# EAGLE design External_Controls_Board (EAGLE 6.6.0)
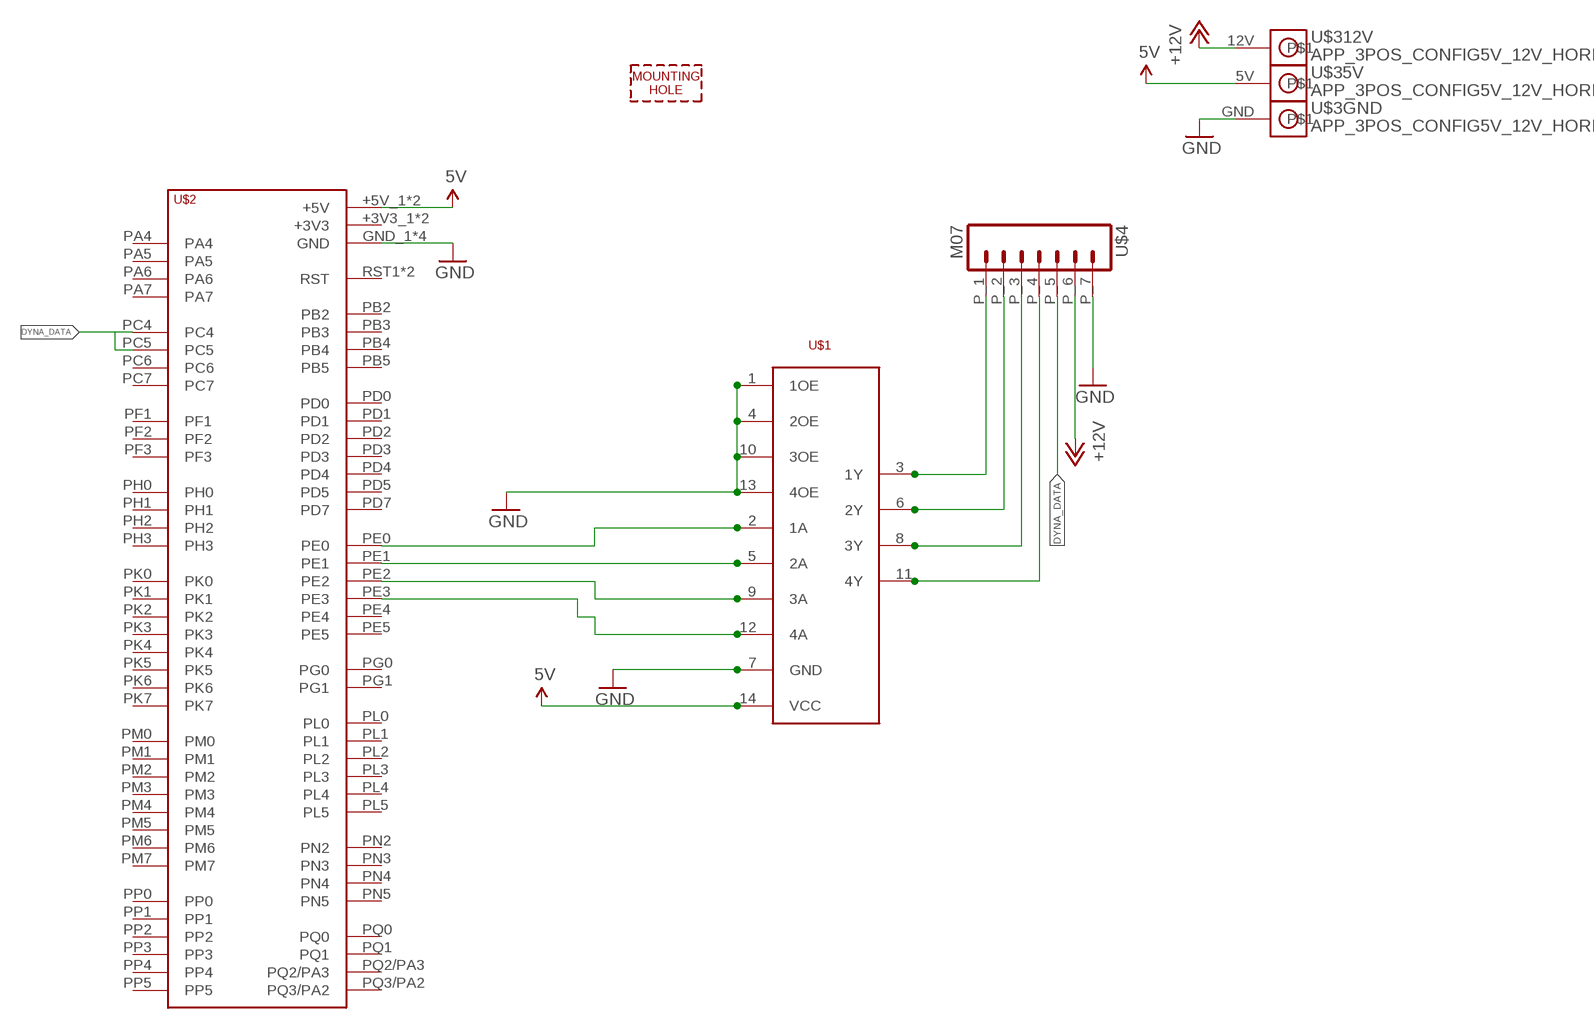
[diagram p0: schematic, sheet 1]

## Parts
U$1  SN74AHCT125  [SOIC14]
U$2  TIVA-C-CONNECTED  [TIVA-C-CONNECTED]
U$3  APP_3POS_CONFIG5V_12V_HORIZ  [APP45_5V_12V_HORIZ_CONFIG]
U$4  M07  [MOLEX_43650-07]
U$6  MOUNTING_HOLE#8  [#8_SCREW]

## Nets
+5V: U$1.14(VCC) U$2.+5V_1(+5V) U$2.+5V_2(+5V) U$3.5V ; supply symbol labelled 5V
+12V: U$3.12V U$4.P_6
DYNA_DATA: U$2.PC4 U$2.PC5 U$4.P_5
GND: U$1.1(1OE) U$1.4(2OE) U$1.7(GND) U$1.10(3OE) U$1.13(4OE) U$2.GND_1(GND) U$2.GND_2(GND) U$2.GND_3(GND) U$2.GND_4(GND) U$3.GND U$4.P_7
PWM0_3.3: U$1.12(4A) U$2.PE3
PWM0_5: U$1.11(4Y) U$4.P_4
PWM1_3.3: U$1.9(3A) U$2.PE2
PWM1_5: U$1.8(3Y) U$4.P_3
PWM2_3.3: U$1.5(2A) U$2.PE1
PWM2_5: U$1.6(2Y) U$4.P_2
PWM3_3.3: U$1.2(1A) U$2.PE0
PWM3_5: U$1.3(1Y) U$4.P_1
Unconnected: U$2.+3V3_1(+3V3) U$2.+3V3_2(+3V3) U$2.PA4 U$2.PA5 U$2.PA6 U$2.PA7 U$2.PB2 U$2.PB3 U$2.PB4 U$2.PB5 U$2.PC6 U$2.PC7 U$2.PD0 U$2.PD1 U$2.PD2 U$2.PD3 U$2.PD4 U$2.PD5 U$2.PD7 U$2.PE4 U$2.PE5 U$2.PF1 U$2.PF2 U$2.PF3 U$2.PG0 U$2.PG1 U$2.PH0 U$2.PH1 U$2.PH2 U$2.PH3 U$2.PK0 U$2.PK1 U$2.PK2 U$2.PK3 U$2.PK4 U$2.PK5 U$2.PK6 U$2.PK7 U$2.PL0 U$2.PL1 U$2.PL2 U$2.PL3 U$2.PL4 U$2.PL5 U$2.PM0 U$2.PM1 U$2.PM2 U$2.PM3 U$2.PM4 U$2.PM5 U$2.PM6 U$2.PM7 U$2.PN2 U$2.PN3 U$2.PN4 U$2.PN5 U$2.PP0 U$2.PP1 U$2.PP2 U$2.PP3 U$2.PP4 U$2.PP5 U$2.PQ0 U$2.PQ1 U$2.PQ2/PA3 U$2.PQ3/PA2 U$2.RST1(RST) U$2.RST_2(RST)

## Library data of the parts
U$1 = MRDT-Digital-ICs:SN74AHCT125: part # SN74AHCT125 QUADRUPLE BUS BUFFER GATES WITH 3-STATE OUTPUTS http://www.digikey.com/product-detail/en/SN74AHCT125DR/296-4652-1-ND/405208
U$2 = MRDT-2015-General:TIVA-C-CONNECTED: TIVA C CONNECTED LAUNCHPAD
U$3 = MRDT-Connectors:APP_3POS_CONFIG; COLOR1: YELLOW; COLOR2: RED; COLOR3: BLACK
U$4 = MRDT-Connectors:M07
U$6 = MRDT-Hardware:MOUNTING_HOLE: Mounting hole for M6 bolt. Standard use mounting hole for: Tiva C Connected - M6 Anderson Powerpole Mounting Wing - M8 Most frame-mounted PCB's - M8

## Board
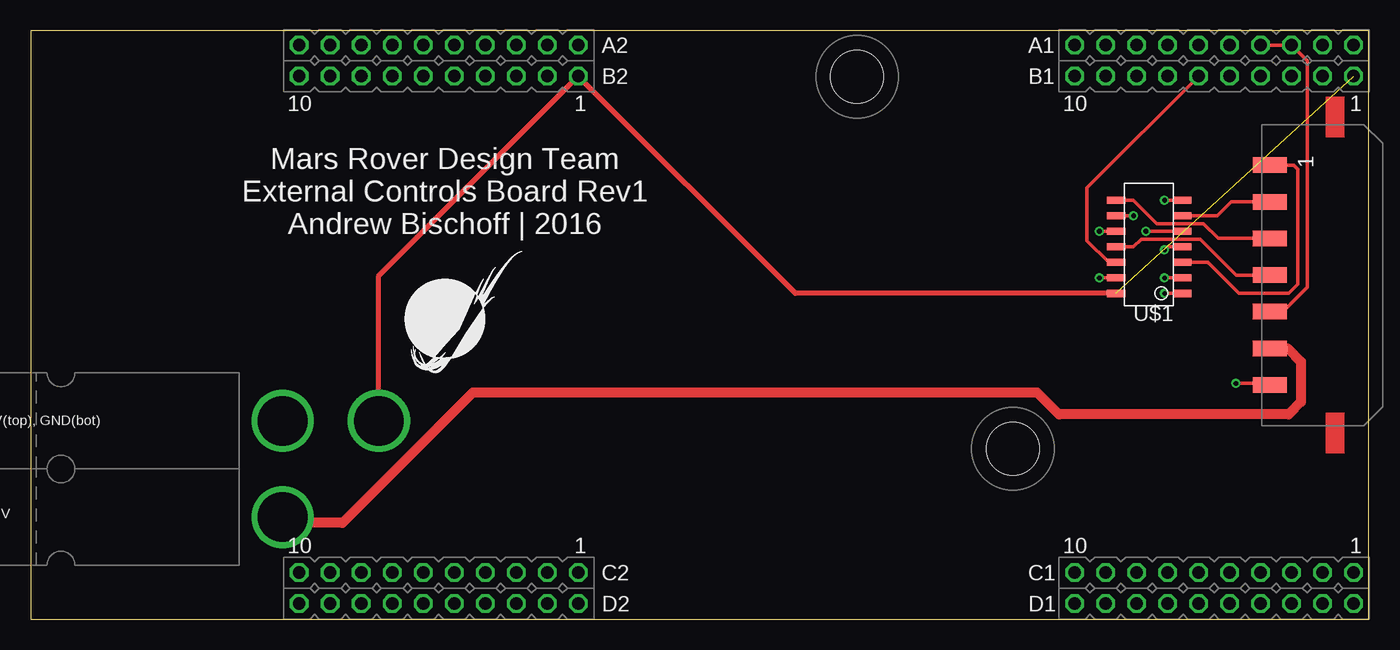
[diagram p1: board, top side]
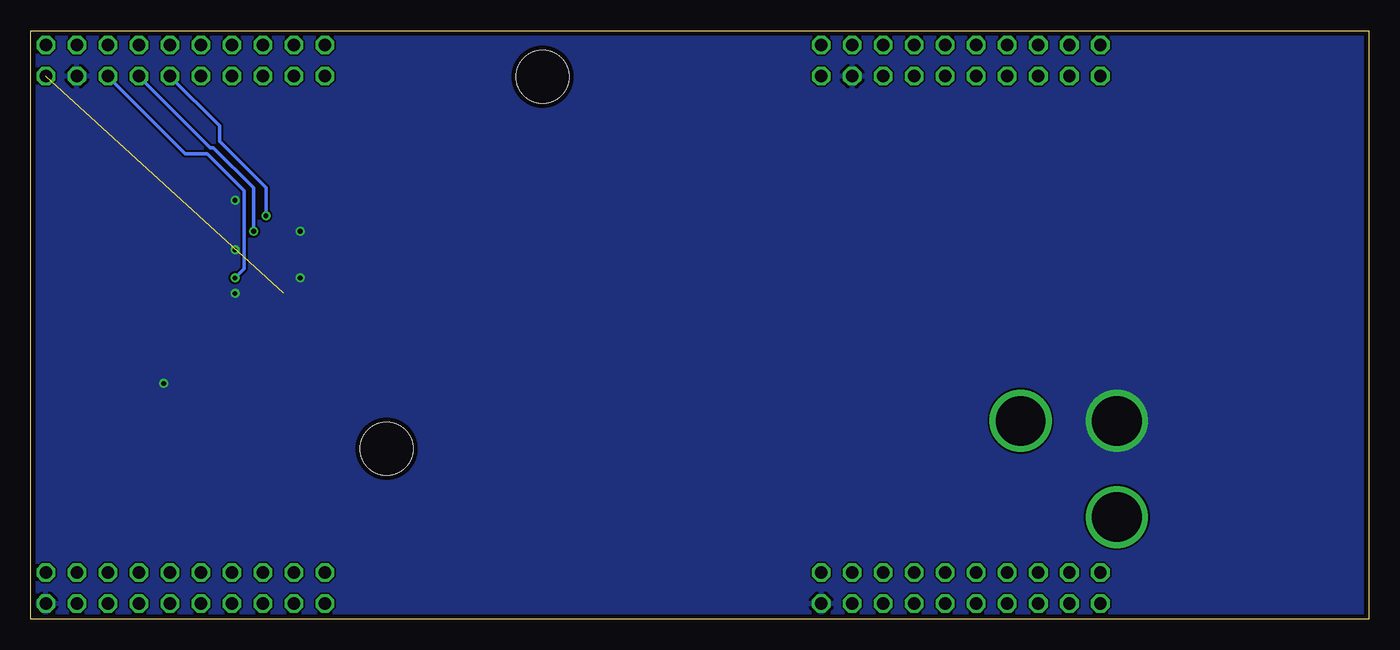
[diagram p2: board, bottom side, seen from below]

Size 109.61 x 48.18 mm. Coordinates in mm from the lower left corner, seen from the top.
Outline: 0,0 109.61,0 109.61,48.18 0,48.18 0,0
Copper layers (1*16): Top 0.0356mm / dielectric 1.5011mm / Bottom 0.0356mm
Design rules "LaenPCBOrder": minimum track width 6mil, minimum drill 13mil, track to track 6mil, track to pad 6mil, pad to pad 6mil, via to via 6mil, smd to smd 6mil, copper to edge 15mil, drill to drill 6mil, minimum pad ring 7mil, minimum via ring 7mil, stop-mask expansion 3mil, vias tented up to drill 0mil, thermal gap 10mil

### Footprints (pad centres in the part's own frame; a part is rotated, then mirrored left to right if it is on the bottom)
SOIC14 = smd 1.5 x 0.6: 1 1.11,10.16; 2 1.11,8.89; 3 1.11,7.62; 4 1.11,6.35; 5 1.11,5.08; 6 1.11,3.81; 7 1.11,2.54; 8 6.51,2.54; 9 6.51,3.81; 10 6.51,5.08; 11 6.51,6.35; 12 6.51,7.62; 13 6.51,8.89; 14 6.51,10.16
TIVA-C-CONNECTED = drill 1.016 octagon: +3V3_1 59.69,54.61; +3V3_2 123.19,54.61; +5V_1 59.69,52.07; +5V_2 123.19,52.07; GND_1 57.15,52.07; GND_2 59.69,8.89; GND_3 120.65,52.07; GND_4 123.19,8.89; PA4 39.37,52.07; PA5 36.83,52.07; PA6 105.41,52.07; PA7 52.07,8.89; PB2 102.87,54.61; PB3 100.33,54.61; PB4 54.61,52.07; PB5 52.07,52.07; PC4 118.11,54.61; PC5 115.57,54.61; PC6 113.03,54.61; PC7 105.41,54.61; PD0 107.95,8.89; PD1 110.49,8.89; PD2 57.15,54.61; PD3 107.95,54.61; PD4 49.53,54.61; PD5 46.99,54.61; PD7 107.95,52.07; PE0 118.11,52.07; PE1 115.57,52.07; PE2 113.03,52.07; PE3 110.49,52.07; PE4 120.65,54.61; PE5 110.49,54.61; PF1 123.19,11.43; PF2 120.65,11.43; PF3 118.11,11.43; PG0 115.57,11.43; PG1 59.69,11.43; PH0 44.45,11.43; PH1 41.91,11.43; PH2 118.11,8.89; PH3 115.57,8.89; PK0 49.53,52.07; PK1 46.99,52.07; PK2 44.45,52.07; PK3 41.91,52.07; PK4 57.15,11.43; PK5 54.61,11.43; PK6 39.37,11.43; PK7 36.83,11.43; PL0 107.95,11.43; PL1 105.41,11.43; PL2 102.87,11.43; PL3 100.33,11.43; PL4 113.03,11.43; PL5 110.49,11.43; PM0 52.07,11.43; PM1 49.53,11.43; PM2 46.99,11.43; PM3 120.65,8.89; PM4 102.87,52.07; PM5 100.33,52.07; PM6 36.83,8.89; PM7 57.15,8.89; PN2 105.41,8.89; PN3 102.87,8.89; PN4 36.83,54.61; PN5 39.37,54.61; PP0 54.61,54.61; PP1 52.07,54.61; PP2 100.33,8.89; PP3 41.91,8.89; PP4 41.91,54.61; PP5 54.61,8.89; PQ0 44.45,54.61; PQ1 39.37,8.89; PQ2/PA3 46.99,8.89; PQ3/PA2 44.45,8.89; RST1 49.53,8.89; RST_2 113.03,8.89
APP45_5V_12V_HORIZ_CONFIG = drill 4.064: 5V 36.068,11.811; 12V 28.194,3.937; GND 28.194,11.811
MOLEX_43650-07 = smd 1.27 x 2.794: P_1 8.966,4.851; P_2 5.969,4.851; P_3 2.972,4.851; P_4 -0.025,4.851; P_5 -3.023,4.851; P_6 -6.02,4.851; P_7 -9.017,4.851
#8_SCREW = hole 4.318: 0,0

### Placement (x,y rotation side)
U$1  95.4,36.83 180 top
U$2  -14.83,-7.62 0 top
U$3  -7.54,4.42 0 top
U$4  106.32,28.19 90 top
U$5  MOUNTING_HOLE#8  [#8_SCREW]  80.44,13.94 0 top
U$6  67.69,44.4 0 top
U$7  [MRDT_LOGO]  30.63,19.3 0 top

### Tracks (layer width: path | path; a pad name or v marks a point on that pad's centre or on a via)
+5V  (1 unrouted)
  Top 0.406: U$1.14 62.64,26.67 U$2.+5V_1 28.52,28.12 U$3.5V
+12V
  Top 0.406: 21.13,7.87 U$3.12V
  Top 0.813: U$4.P_6 102.95,22.17 104.04,21.08 104.04,17.78 103.02,16.76 84.23,16.76 82.45,18.54 36.22,18.54 25.55,7.87 21.13,7.87
DYNA_DATA
  Top 0.279: U$4.P_5 102.54,25.17 104.55,27.18 104.55,45.72 U$2.PC4 U$2.PC5
GND  (via drill 0.38)
  Top 0.305: U$1.13 v87.53,27.94 | U$1.10 v87.53,31.75 | U$1.7 v92.86,34.29 | U$1.4 93.12,30.48 v92.86,30.23 | U$1.1 v92.86,26.67 | U$4.P_7 101.37,19.18 101.24,19.3 v98.7,19.3
  pour Bottom: 0.15,0 109.63,0 109.63,48.26 0.15,48.26
PWM0_3.3
  Top 0.305: U$1.12 88.29,29.21 86.51,30.99 86.51,35.31 U$2.PE3
PWM0_5
  Top 0.279: U$4.P_4 98.73,28.17 95.78,31.11 90.96,31.11 90.32,30.48 U$1.11
PWM1_3.3  (via drill 0.38)
  Top 0.305: U$1.9 v90.32,33.02
  Bottom 0.305: v90.32,33.02 90.32,35.31 94.13,39.12 94.13,40.39 U$2.PE2
PWM1_5
  Top 0.279: U$4.P_3 97.26,31.17 96.04,32.39 92.23,32.39 90.32,34.29 U$1.8
PWM2_3.3  (via drill 0.38)
  Top 0.305: U$1.5 v91.34,31.75
  Bottom 0.305: v91.34,31.75 91.34,35.31 94.64,38.61 94.89,38.61 U$2.PE1
PWM2_5
  Top 0.279: U$4.P_2 98.32,34.16 97.18,33.02 U$1.6
PWM3_3.3  (via drill 0.38)
  Top 0.305: U$1.2 v92.86,27.94
  Bottom 0.305: v92.86,27.94 92.1,28.7 92.1,35.05 95.15,38.1 96.93,38.1 U$2.PE0
PWM3_5
  Top 0.279: U$4.P_1 103.45,37.16 103.78,36.83 103.78,27.43 103.02,26.67 98.96,26.67 96.42,29.21 U$1.3

### Text on the board
tPlace: Mars Rover Design Team / External Controls Board Rev1 / Andrew Bischoff | 2016